# EAGLE schematic Inverter_Half_H-Bridge_40A_1mhz (EAGLE 6.5.0)
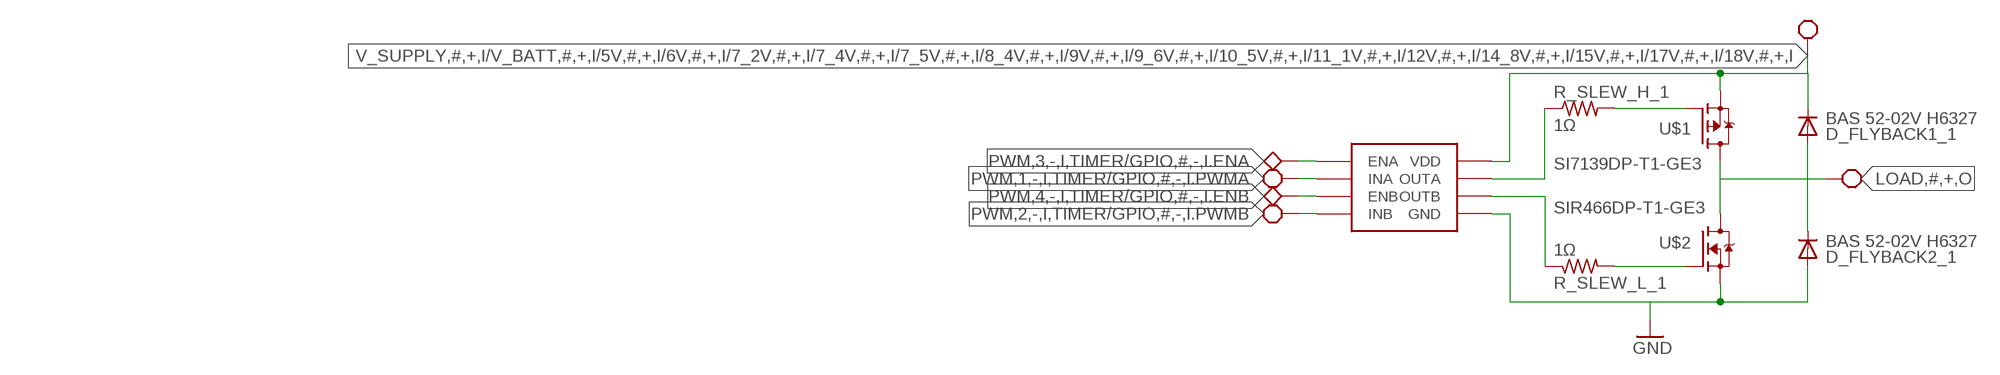
[diagram p0: schematic, sheet 1]

## Parts
D_FLYBACK1_1  BAS 52-02V H6327  DIODE-SOD523  [SOD523]
D_FLYBACK2_1  BAS 52-02V H6327  DIODE-SOD523  [SOD523]
R_SLEW_H_1  1Ω  R-US_R0603  [R0603]
R_SLEW_L_1  1Ω  R-US_R0603  [R0603]
U$1  SI7139DP-T1-GE3  [S0-8-POWERPAK]
U$2  SIR466DP-T1-GE3  [S0-8-POWERPAK]
U$3  UCC2752XUCC27524DSD  [8-WDFN]

## Nets
DRIVER_OUT_H_1: R_SLEW_H_1.1 U$3.P7(OUTA)
DRIVER_OUT_L_1: R_SLEW_L_1.1 U$3.P5(OUTB)
GATE_H_1: R_SLEW_H_1.2 U$1.4(G)
GATE_L_1: R_SLEW_L_1.2 U$2.4(G)
GND: D_FLYBACK2_1.A U$2.1(S) U$2.2(S) U$2.3(S) U$3.EP(GND) U$3.P3(GND)
LOAD,#,+,O: D_FLYBACK1_1.A D_FLYBACK2_1.C U$1.5(D) U$1.6(D) U$1.7(D) U$1.8(D) U$1.P$1(D) U$2.5(D) U$2.6(D) U$2.7(D) U$2.8(D) U$2.P$1(D) ; supply symbol labelled BLOCK_REQUIREMENT
PWM,1,-,I,TIMER/GPIO,#,-,I.PWMA: U$3.P2(INA) ; supply symbol labelled BLOCK_REQUIREMENT
PWM,2,-,I,TIMER/GPIO,#,-,I.PWMB: U$3.P4(INB) ; supply symbol labelled BLOCK_REQUIREMENT
PWM,3,-,I,TIMER/GPIO,#,-,I.ENA: U$3.P1(ENA) ; supply symbol labelled BLOCK_RECOMMENDED
PWM,4,-,I,TIMER/GPIO,#,-,I.ENB: U$3.P8(ENB) ; supply symbol labelled BLOCK_RECOMMENDED
V_SUPPLY,#,+,I/V_BATT,#,+,I/5V,#,+,I/6V,#,+,I/7_2V,#,+,I/7_4V,#,+,I/7_5V,#,+,I/8_4V,#,+,I/9V,#,+,I/9_6V,#,+,I/10_5V,#,+,I/11_1V,#,+,I/12V,#,+,I/14_8V,#,+,I/15V,#,+,I/17V,#,+,I/18V,#,+,I: D_FLYBACK1_1.C U$1.1(S) U$1.2(S) U$1.3(S) U$3.P6(VDD) ; supply symbol labelled BLOCK_REQUIREMENT

## Library data of the parts
D_FLYBACK1_1 D_FLYBACK2_1 = diode:DIODE-: DIODE
R_SLEW_H_1 R_SLEW_L_1 = rcl:R-US_: RESISTOR, American symbol
U$1 = piccoli:SI7139DP-T1-GE3
U$2 = piccoli:SIR466DP-T1-GE3
U$3 = piccoli:UCC2752X: Dual 5-A High-Speed Low-Side Gate Driver